# Altium schematic sheet DDR3 Power.SchDoc
size A3; SheetNumber: 9; SheetTotal: 12
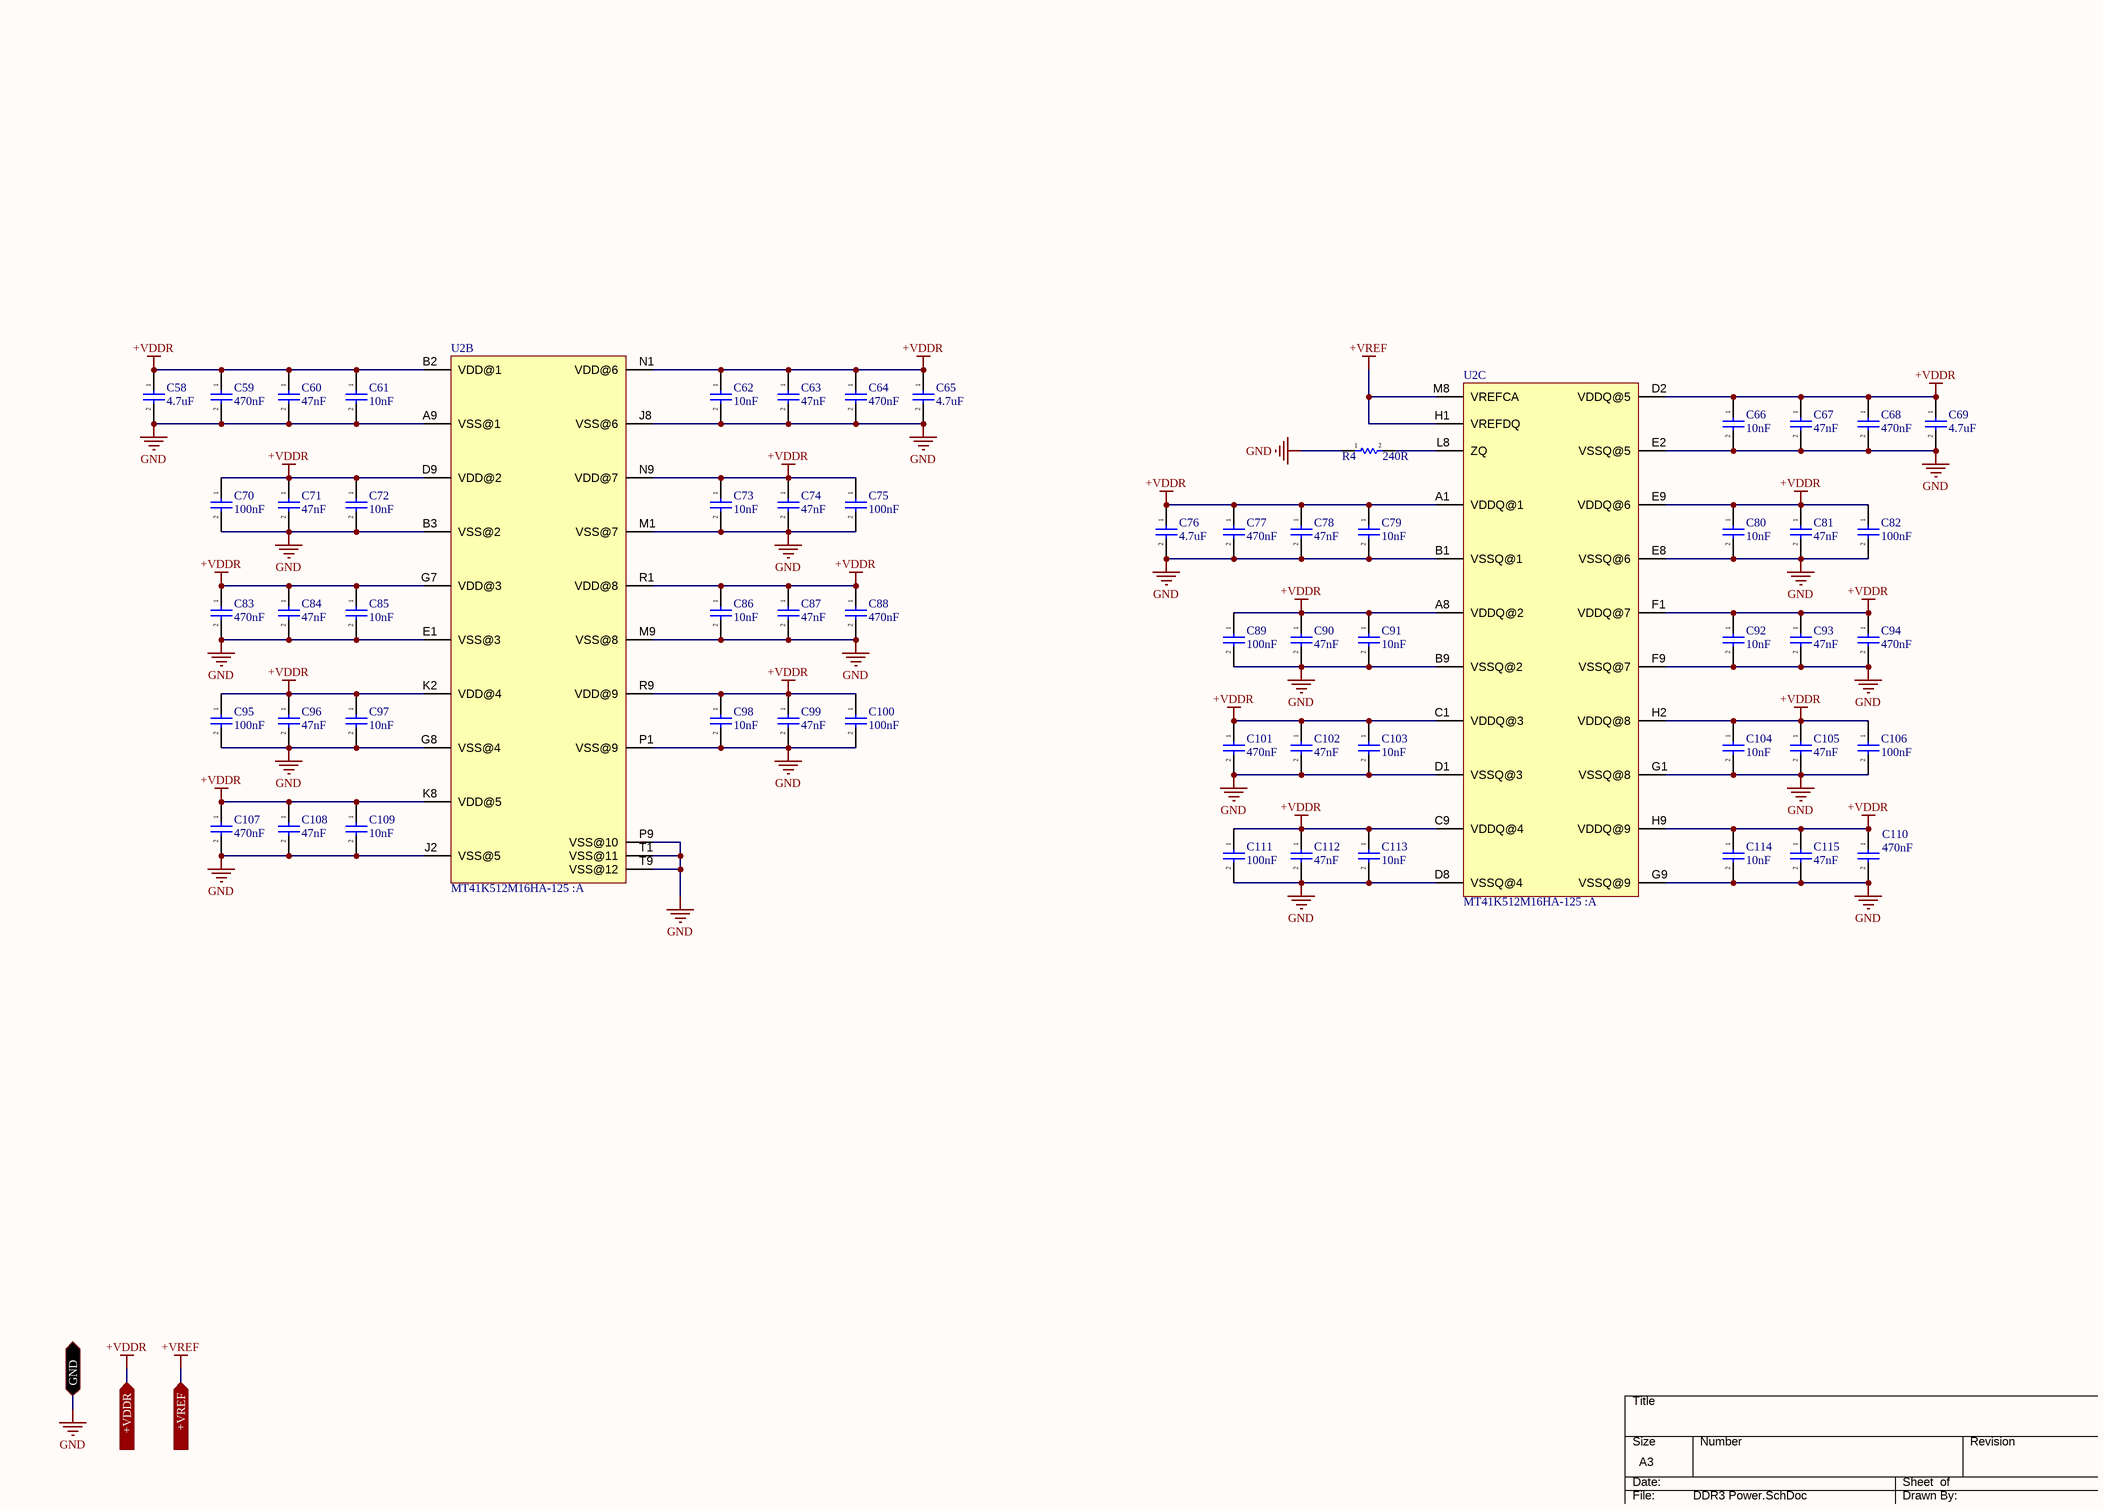
[diagram p0: DDR3 Power.SchDoc]

## Parts
C58  4.7uF  [CAP_0805]
C59  470nF  [CAP_0402]
C60  47nF  [CAP_0201]
C61  10nF  [CAP_0201]
C62  10nF  [CAP_0201]
C63  47nF  [CAP_0201]
C64  470nF  [CAP_0402]
C65  4.7uF  [CAP_0805]
C66  10nF  [CAP_0201]
C67  47nF  [CAP_0201]
C68  470nF  [CAP_0402]
C69  4.7uF  [CAP_0805]
C70  100nF  [CAP_0402]
C71  47nF  [CAP_0201]
C72  10nF  [CAP_0201]
C73  10nF  [CAP_0201]
C74  47nF  [CAP_0201]
C75  100nF  [CAP_0402]
C76  4.7uF  [CAP_0805]
C77  470nF  [CAP_0402]
C78  47nF  [CAP_0201]
C79  10nF  [CAP_0201]
C80  10nF  [CAP_0201]
C81  47nF  [CAP_0201]
C82  100nF  [CAP_0402]
C83  470nF  [CAP_0402]
C84  47nF  [CAP_0201]
C85  10nF  [CAP_0201]
C86  10nF  [CAP_0201]
C87  47nF  [CAP_0201]
C88  470nF  [CAP_0402]
C89  100nF  [CAP_0402]
C90  47nF  [CAP_0201]
C91  10nF  [CAP_0201]
C92  10nF  [CAP_0201]
C93  47nF  [CAP_0201]
C94  470nF  [CAP_0402]
C95  100nF  [CAP_0402]
C96  47nF  [CAP_0201]
C97  10nF  [CAP_0201]
C98  10nF  [CAP_0201]
C99  47nF  [CAP_0201]
C100  100nF  [CAP_0402]
C101  470nF  [CAP_0402]
C102  47nF  [CAP_0201]
C103  10nF  [CAP_0201]
C104  10nF  [CAP_0201]
C105  47nF  [CAP_0201]
C106  100nF  [CAP_0402]
C107  470nF  [CAP_0402]
C108  47nF  [CAP_0201]
C109  10nF  [CAP_0201]
C110  470nF  [CAP_0402]
C111  100nF  [CAP_0402]
C112  47nF  [CAP_0201]
C113  10nF  [CAP_0201]
C114  10nF  [CAP_0201]
C115  47nF  [CAP_0201]
R4  240R  [RES_0402]
U2  MT41K512M16HA-125 :A  [FBGA-96]  (parts B,C of 3)

## Ports
+VDDR (in), +VREF (in), GND (bidir)

## Nets
+VDDR: C58.1 C59.1 C60.1 C61.1 C62.1 C63.1 C64.1 C65.1 C66.1 C67.1 C68.1 C69.1 C70.1 C71.1 C72.1 C73.1 C74.1 C75.1 C76.1 C77.1 C78.1 C79.1 C80.1 C81.1 C82.1 C83.1 C84.1 C85.1 C86.1 C87.1 C88.1 C89.1 C90.1 C91.1 C92.1 C93.1 C94.1 C95.1 C96.1 C97.1 C98.1 C99.1 C100.1 C101.1 C102.1 C103.1 C104.1 C105.1 C106.1 C107.1 C108.1 C109.1 C110.1 C111.1 C112.1 C113.1 C114.1 C115.1 U2.A1(VDDQ@1) U2.A8(VDDQ@2) U2.B2(VDD@1) U2.C1(VDDQ@3) U2.C9(VDDQ@4) U2.D2(VDDQ@5) U2.D9(VDD@2) U2.E9(VDDQ@6) U2.F1(VDDQ@7) U2.G7(VDD@3) U2.H2(VDDQ@8) U2.H9(VDDQ@9) U2.K2(VDD@4) U2.K8(VDD@5) U2.N1(VDD@6) U2.N9(VDD@7) U2.R1(VDD@8) U2.R9(VDD@9) ; port +VDDR
+VREF: U2.H1(VREFDQ) U2.M8(VREFCA) ; port +VREF
GND: C58.2 C59.2 C60.2 C61.2 C62.2 C63.2 C64.2 C65.2 C66.2 C67.2 C68.2 C69.2 C70.2 C71.2 C72.2 C73.2 C74.2 C75.2 C76.2 C77.2 C78.2 C79.2 C80.2 C81.2 C82.2 C83.2 C84.2 C85.2 C86.2 C87.2 C88.2 C89.2 C90.2 C91.2 C92.2 C93.2 C94.2 C95.2 C96.2 C97.2 C98.2 C99.2 C100.2 C101.2 C102.2 C103.2 C104.2 C105.2 C106.2 C107.2 C108.2 C109.2 C110.2 C111.2 C112.2 C113.2 C114.2 C115.2 R4.1 U2.A9(VSS@1) U2.B1(VSSQ@1) U2.B3(VSS@2) U2.B9(VSSQ@2) U2.D1(VSSQ@3) U2.D8(VSSQ@4) U2.E1(VSS@3) U2.E2(VSSQ@5) U2.E8(VSSQ@6) U2.F9(VSSQ@7) U2.G1(VSSQ@8) U2.G8(VSS@4) U2.G9(VSSQ@9) U2.J2(VSS@5) U2.J8(VSS@6) U2.M1(VSS@7) U2.M9(VSS@8) U2.P1(VSS@9) U2.P9(VSS@10) U2.T1(VSS@11) U2.T9(VSS@12) ; port GND
NetR4_2: R4.2 U2.L8(ZQ)

## Notes on the sheet
- DWG NO:
- REV:
- THIS DOCUMENT AND THE DATA DISCLOSED HEREIN OR
- HEREWITH IS THE PROPERTY OF ALTIUM LIMITED AND MAY
- BE FREELY DISTRIBUTED IN WHOLE. NO RIGHTS ARE
- RESERVED OR EXPRESS OR IMPLIED WARANTEE GIVEN.
- REVISION
- DESCRIPTION
- DATE
- APPROVED
- ENG:
- APPROVALS
- PROJECT
- DSN:
- CHK:
- REFERENCE DOCUMENTS
- PROJECT REVISION:
- TITLE
- DOCUMENT REVISION:
- DESIGN ITEM:
- BOM:
- FAB DWG:
- PCB DWG:
- ASSY DWG:
- SCALE:
- FILE NAME
- A2
- SIZE
- CAGE CODE
- DWG NO.
- SHEET
- OF
- REV

## Library data of the parts
C58-C115 = CAP_CER: Generic SMT Ceramic Capacitor; Voltage - Rated: 25V; Operating Temperature: *; Tolerance: *; Mfr: *; ComponentLink1Description: Digikey; ComponentLink1URL: [Digikey Link]; Digikey Part No: *; ComponentLink2Description: Datasheet; ComponentLink2URL: [Datasheet Link]
  C58 C65 C69 C76: Footprint: 0805
  C59 C64 C68 C70 C75 C77 C82 C83 C88 C89 C94 C95 C100 C101 C106 C107 C110 C111: Footprint: 0402
  C60-C63 C66 C67 C71-C74 C78-C81 C84-C87 C90-C93 C96-C99 C102-C105 C108 C109 C112-C115: Footprint: 0201
R4 = RESISTOR: Power: 1/8W; Tolerance: 1%; Automotive: *; Operating Temperature: *; # Digikey: *; ComponentLink1Description: Digikey; ComponentLink1URL: *; # Manufacturer: *; Package / Case: 0402
U2 = IC_MT41K512M16HA-125: DRAM 8G 1.35V 512Mx16 800 MHz DDR3 0C-90C; Mfr: Alliance Memory; Data Bus Width: 16 bits; Memory Size: 8Gb; Maximum Clock Frequency: 800MHz; Supply Voltage (Max): 1.45V; Supply Voltage (Min): 1.283V; Supply Current (Max): 88mA; Package / Case: FBGA-96; Type: SDRAM - DDR3L; Memory Organization: 512M x 16; Operating Temperature: 0C - 95C